# Altium project CCjammerRev1.PrjPCB
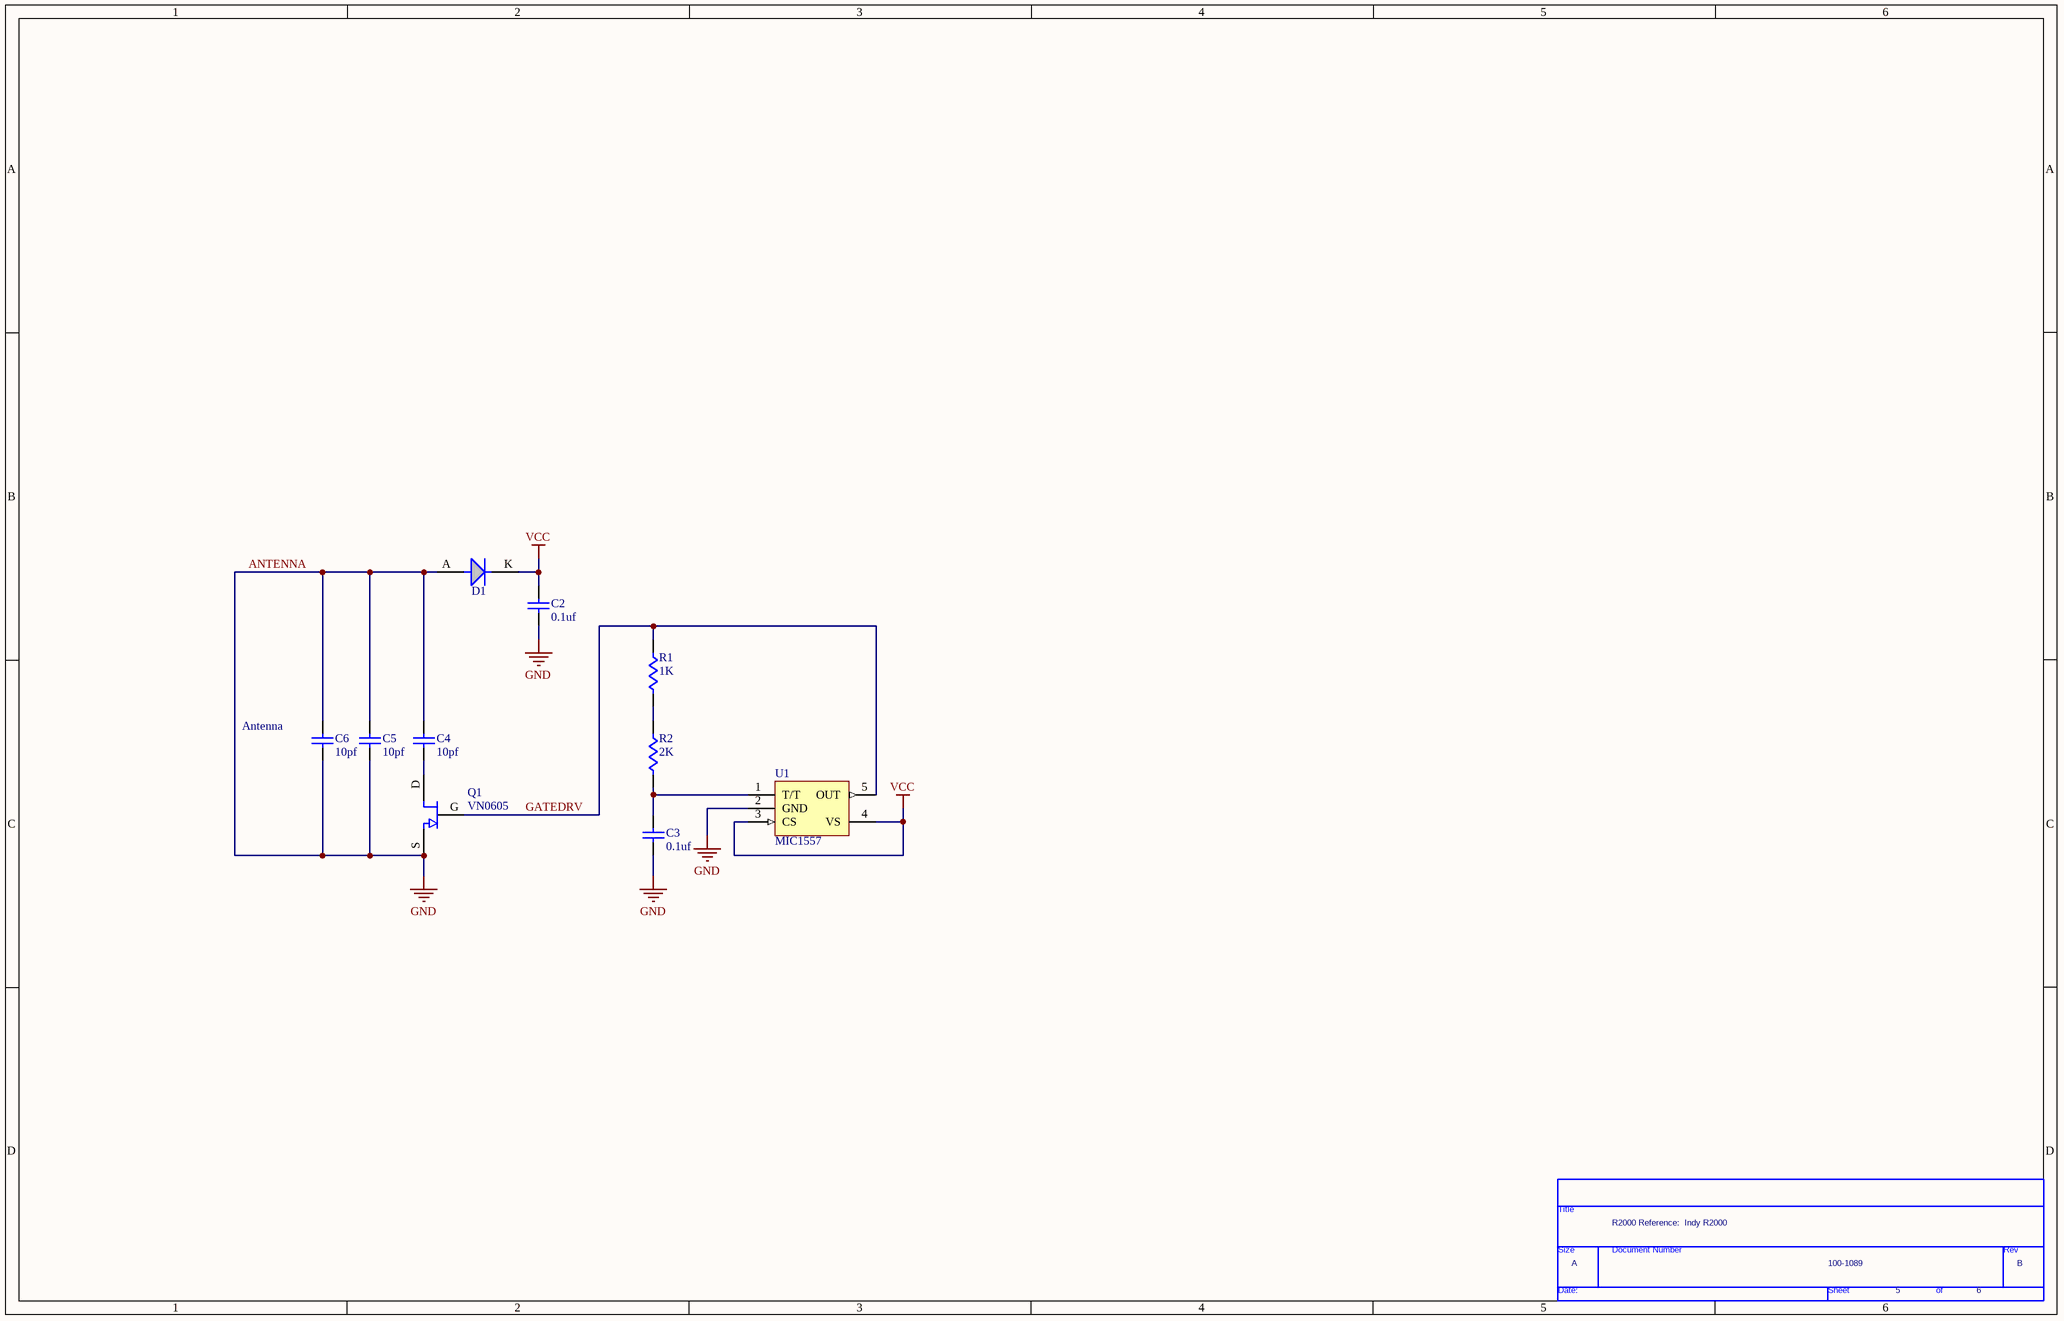
[diagram p0: CCjammerRev1_TOP.SchDoc]
1 sheet, 11 parts. Net scope: global (net labels, ports and power ports of the same name join across sheets).
Board file: CCjammerRev1.PcbDoc

## Sheet CCjammerRev1_TOP.SchDoc
size 386 x 246 mm

### Parts
*  Page Count: 6  Page Number: 5  Page Size: A  Title: R2000 Reference:  Indy R2000  RevCode: B  Doc: 100-1089  (hidden comment: TitleBlock0)  (graphical)
C2  0.1uf  [0603_072205]
C3  0.1uf  [0603_072205]
C4  10pf  [0603_072205]
C5  10pf  [0603_072205]
C6  10pf  [0603_072205]
D1  DIODE  [SOD323_072005]  (value not drawn)
Q1  VN0605  [SOT23 FET_012005]
R1  1K  [0603_072205]
R2  2K  [0603_072205]
U1  MIC1557  [SOT25_030205]

### Nets
ANTENNA: C2.1 C3.1 C4.2 C5.1 C5.2 C6.1 C6.2 D1.A Q1.S U1.2(GND)  [also labelled GND]
VCC: C2.2 D1.K U1.3(CS) U1.4(VS)
GATEDRV: Q1.G R1.2 U1.5(OUT)
NetC3_2: C3.2 R2.1 U1.1(T/T)
NetC4_1: C4.1 Q1.D
NetR1_1: R1.1 R2.2

### Notes on the sheet
- (near C6) Antenna
- (in symbol TitleBlock0) Title; Size; Document Number; Rev; Date:; Sheet; of

### Library data of the parts
C2 = Cap: Capacitor; PARTNO: TMK212BJ475KG-T; MAN: Taiyo Yuden; VALUE: 0.1uf; DK: 587-1782-1-ND
C3-C6 = Cap: Capacitor
  C3: VALUE: 0.1uf
  C4-C6: VALUE: 10pf
D1 = DIODE: PARTNO: 568-6022-2-ND; VALUE: BAT721,215; MFG: NXP SEMICONDUCTOR
Q1 = FET N CHANNEL: PARTNO: VN0605T; MFG: Vishay; VALUE: VN0605; Mouser: 781-VN0605T
R1 R2 = RESISTOR: PARTNO: RES-0000
  R1: VALUE: 1K
  R2: VALUE: 2K
U1 = MIC1555: PARTNO: MIC1557YM5; MFG: Micrel; VALUE: MIC1557
* = TitleBlock0: Page Create Date: March  8, 1995